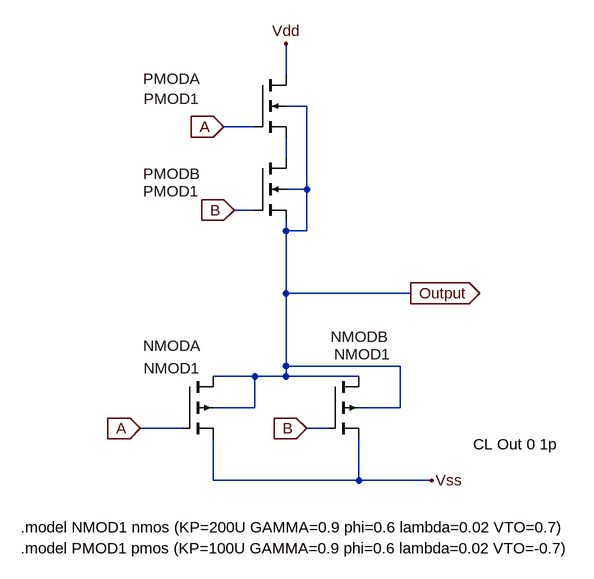
[diagram p0: schematic circnor.asc]
circnor.asc, the LTspice schematic file:
Version 4
SHEET 1 880 680
WIRE 288 -400 288 -448
WIRE 320 -352 288 -352
WIRE 240 -320 192 -320
WIRE 288 -272 288 -304
WIRE 320 -224 320 -352
WIRE 320 -224 288 -224
WIRE 240 -192 208 -192
WIRE 288 -160 288 -176
WIRE 320 -160 320 -224
WIRE 320 -160 288 -160
WIRE 288 -64 288 -160
WIRE 480 -64 288 -64
WIRE 288 48 288 -64
WIRE 464 48 288 48
WIRE 240 64 176 64
WIRE 288 64 288 48
WIRE 288 64 240 64
WIRE 400 64 288 64
WIRE 240 112 240 64
WIRE 240 112 176 112
WIRE 464 112 464 48
WIRE 464 112 400 112
WIRE 128 144 64 144
WIRE 352 144 320 144
WIRE 176 224 176 160
WIRE 400 224 400 160
WIRE 400 224 176 224
WIRE 512 224 400 224
FLAG 64 144 A
IOPIN 64 144 In
FLAG 192 -320 A
IOPIN 192 -320 In
FLAG 320 144 B
IOPIN 320 144 In
FLAG 208 -192 B
IOPIN 208 -192 In
FLAG 480 -64 Output
IOPIN 480 -64 Out
FLAG 288 -448 Vdd
FLAG 512 224 Vss
SYMBOL pmos4 128 64 R0
WINDOW 0 -60 -47 Left 2
WINDOW 3 -59 -13 Left 2
SYMATTR InstName NMODA
SYMATTR Value NMOD1
SYMATTR Value2 l=1u w=50u
SYMBOL pmos4 352 64 R0
WINDOW 0 5 -61 Left 2
WINDOW 3 10 -34 Left 2
SYMATTR InstName NMODB
SYMATTR Value NMOD1
SYMATTR Value2 l=1u w=50u
SYMBOL nmos4 240 -400 R0
WINDOW 0 -172 6 Left 2
WINDOW 3 -171 37 Left 2
SYMATTR InstName PMODA
SYMATTR Value PMOD1
SYMATTR Value2 l=1u w=50u
SYMBOL nmos4 240 -272 R0
WINDOW 0 -172 24 Left 2
WINDOW 3 -172 51 Left 2
SYMATTR InstName PMODB
SYMATTR Value PMOD1
SYMATTR Value2 l=1u w=100u
TEXT -120 296 Left 2 !.model NMOD1 nmos (KP=200U GAMMA=0.9 phi=0.6 lambda=0.02 VTO=0.7)
TEXT -120 328 Left 2 !.model PMOD1 pmos (KP=100U GAMMA=0.9 phi=0.6 lambda=0.02 VTO=-0.7)
TEXT 576 168 Left 2 !CL Out 0 1p

The netlist it stands for:
* circnor.asc
M§NMODA Output A Vss Output NMOD1 l=1u w=50u
M§NMODB Output B Vss Output NMOD1 l=1u w=50u
M§PMODA Vdd A N001 Output PMOD1 l=1u w=50u
M§PMODB N001 B Output Output PMOD1 l=1u w=100u
.model NMOS NMOS
.model PMOS PMOS
.lib standard.mos
.model NMOD1 nmos (KP=200U GAMMA=0.9 phi=0.6 lambda=0.02 VTO=0.7)
.model PMOD1 pmos (KP=100U GAMMA=0.9 phi=0.6 lambda=0.02 VTO=-0.7)
CL Out 0 1p
.backanno
.end